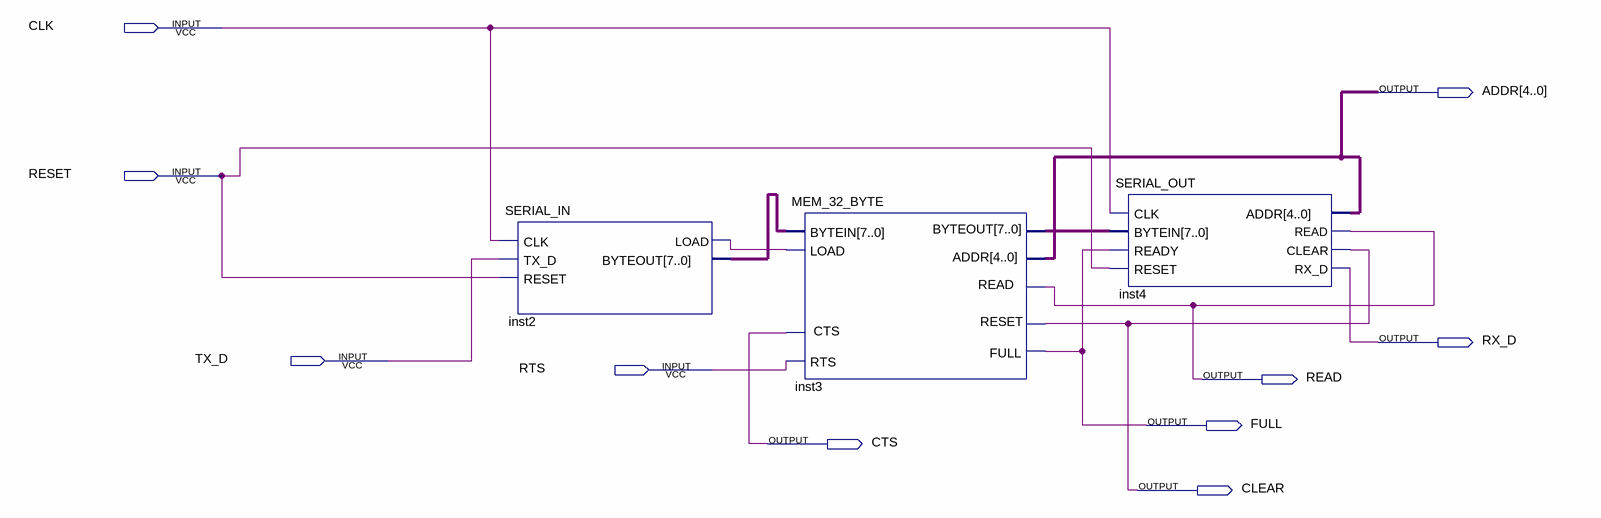
[diagram p0: schematic sheet]
// Quartus schematic SerialtoSPI.bdf as structural Verilog: 3 symbols, 10 pins
module SerialtoSPI (
  input  CLK,
  input  RESET,
  input  TX_D,
  input  RTS,
  output [4:0] ADDR,
  output RX_D,
  output READ,
  output FULL,
  output CTS,
  output CLEAR
);

  wire inst2_load;
  wire [7:0] inst2_byteout, inst3_byteout;

  SERIAL_IN inst2 (.CLK(CLK), .TX_D(TX_D), .RESET(RESET), .LOAD(inst2_load), .BYTEOUT(inst2_byteout));
  MEM_32_BYTE inst3 (
    .LOAD(inst2_load), .BYTEIN(inst2_byteout), .ADDR(ADDR), .READ(READ), .RTS(RTS), .RESET(CLEAR),
    .BYTEOUT(inst3_byteout), .CTS(CTS), .FULL(FULL));
  SERIAL_OUT inst4 (
    .CLK(CLK), .BYTEIN(inst3_byteout), .READY(FULL), .RESET(RESET), .ADDR(ADDR), .READ(READ), .CLEAR(CLEAR),
    .RX_D(RX_D));
endmodule
